# EAGLE schematic item_2022_Motherboard_02 (EAGLE 9.6.2)

## Sheet 1 of 2
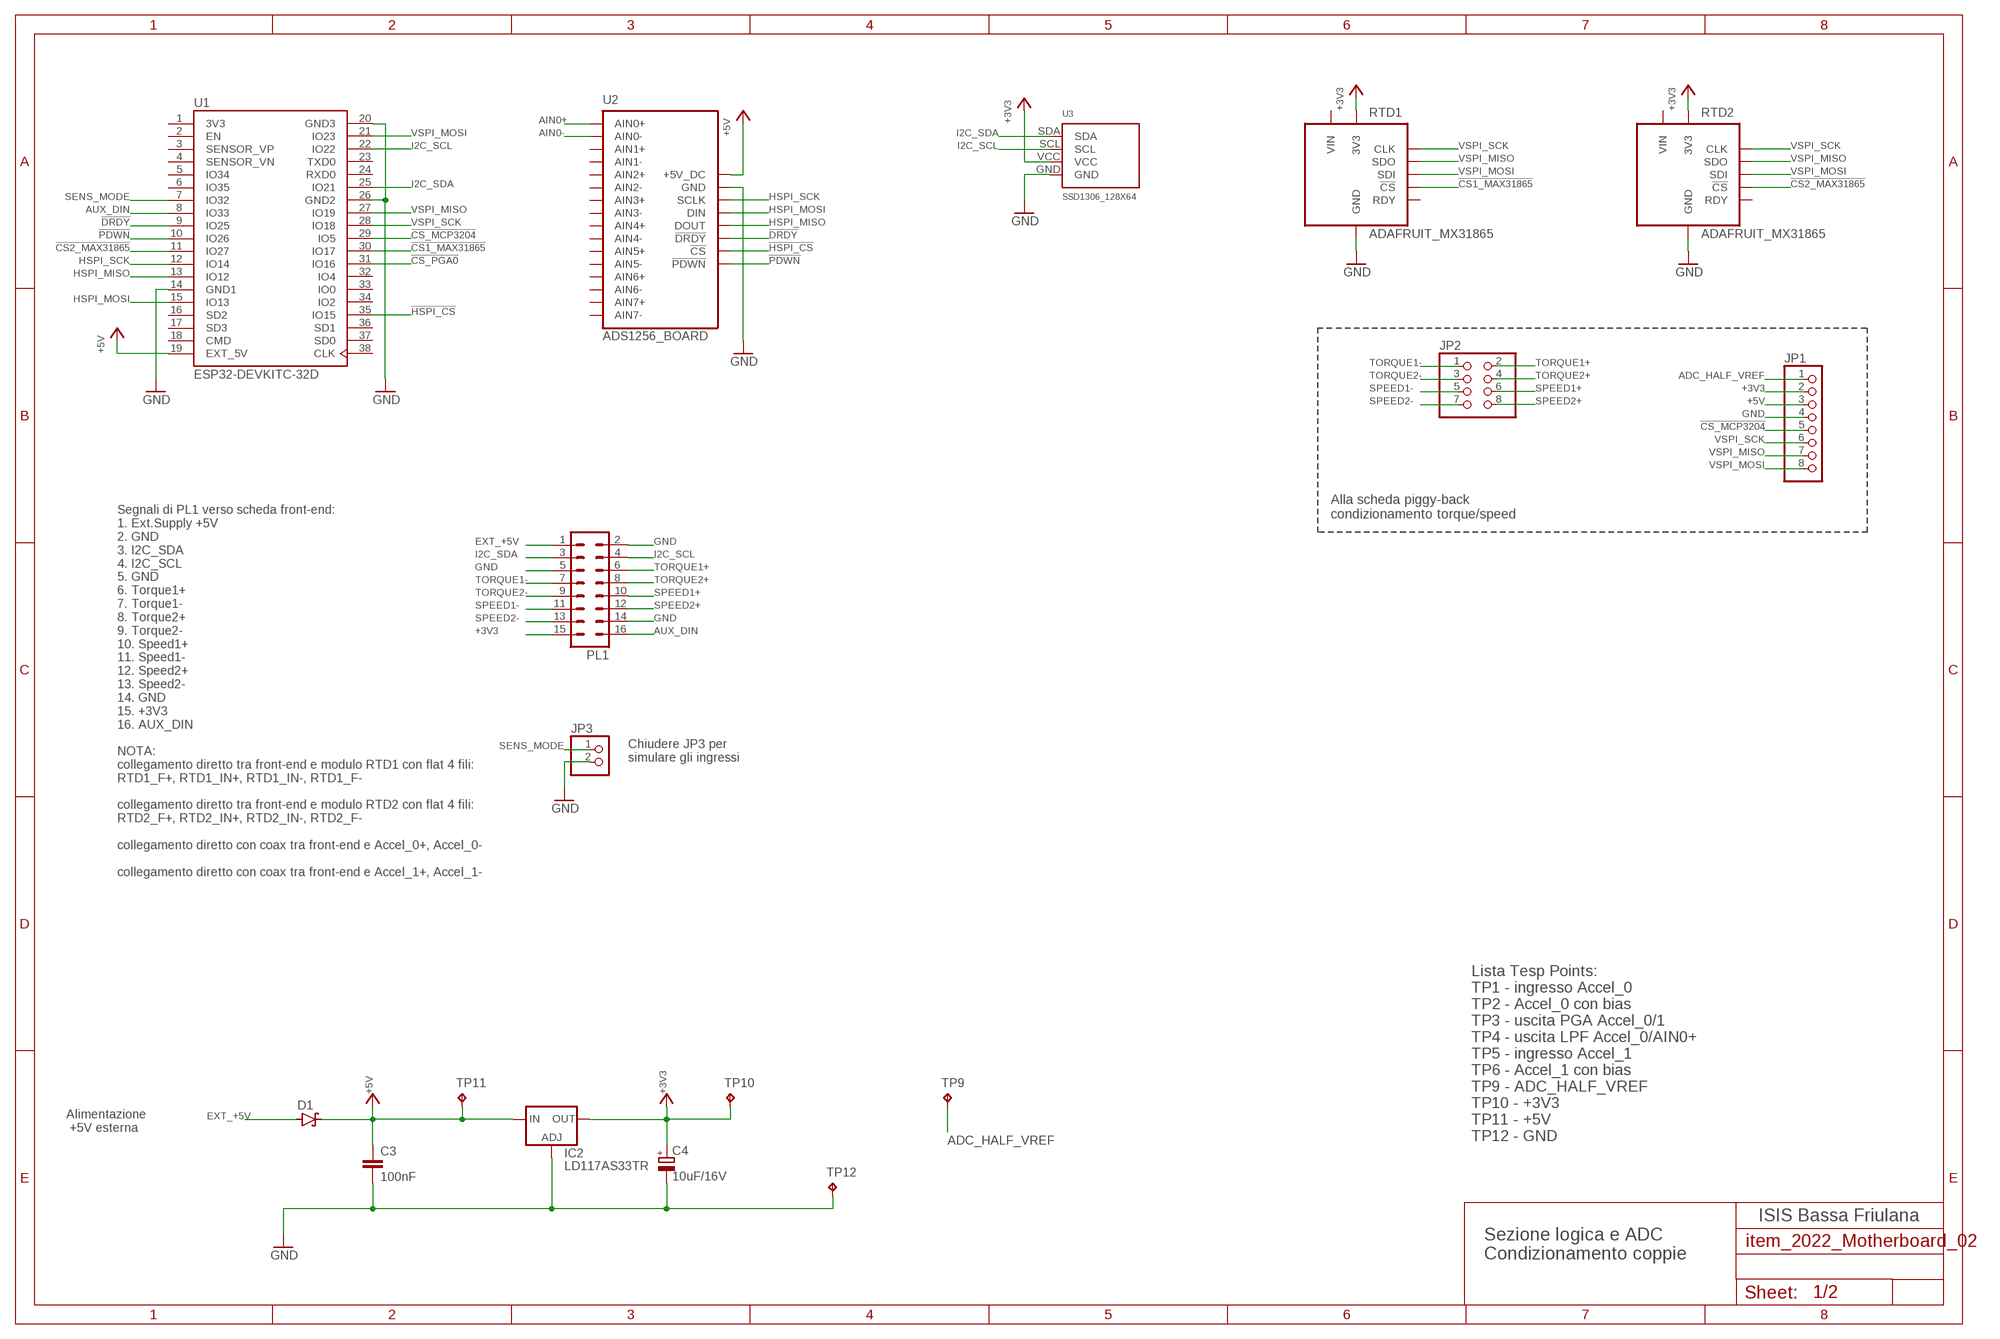
[diagram p0: schematic, sheet 1]

### Parts
C3  100nF  C-EUC0805K  [C0805K]
C4  10uF/16V  CPOL-EU153CLV-0405  [153CLV-0405]
D1  SCHOTTKY-DIODEDO35-7  [DO35-7]
IC2  LD117AS33TR  [SOT223]
JP1  PINHD-1X8  [1X08]
JP2  PINHD-2X4  [2X04]
JP3  PINHD-1X2  [1X02]
PL1  16V  [16V]
RTD1  ADAFRUIT_MX31865  [ADAFRUIT_MAX31865]
RTD2  ADAFRUIT_MX31865  [ADAFRUIT_MAX31865]
TP9  TPTP16SQ  [TP16SQ]
TP10  TPTP16SQ  [TP16SQ]
TP11  TPTP16SQ  [TP16SQ]
TP12  TPTP14R  [TP14R]
U1  ESP32-DEVKITC-32D  [MODULE_ESP32-DEVKITC-32D]
U2  ADS1256_BOARD  [ADS1256_BOARD]
U3  SSD1306_128X64  [128X64]

### Nets
!CS1_MAX31865!: RTD1.P7(!CS!) U1.30(IO17)
!CS2_MAX31865!: RTD2.P7(!CS!) U1.11(IO27)
!CS_MCP3204!: JP1.5 U1.29(IO5)
!CS_PGA0!: U1.31(IO16) ; also sheet 2
!DRDY!: U1.9(IO25) U2.!DRDY!
!HSPI_CS!: U1.35(IO15) U2.!CS!
!PDWN!: U1.10(IO26) U2.PDWN(!PDWN!)
+3V3: C4.+ IC2.4(OUT) JP1.2 PL1.15 RTD1.P3(3V3) RTD2.P3(3V3) TP10.TP U3.VCC
+5V: C3.1 D1.C IC2.3(IN) JP1.3 TP11.TP U1.19(EXT_5V) U2.5V_DC(+5V_DC) ; also sheet 2
ADC_HALF_VREF [supply]: JP1.1 TP9.TP ; also sheet 2
AIN0+: U2.AIN0+ ; also sheet 2
AIN0-: U2.AIN0- ; also sheet 2
AUX_DIN: PL1.16 U1.8(IO33)
EXT_+5V: D1.A PL1.1
GND: C3.2 C4.- IC2.1(ADJ) JP1.4 JP3.2 PL1.2 PL1.5 PL1.14 RTD1.P2(GND) RTD2.P2(GND) TP12.TP U1.14(GND1) U1.20(GND3) U1.26(GND2) U2.GND U3.GND ; also sheet 2
HSPI_MISO: U1.13(IO12) U2.DOUT
HSPI_MOSI: U1.15(IO13) U2.DIN
HSPI_SCK: U1.12(IO14) U2.SCLK
I2C_SCL: PL1.4 U1.22(IO22) U3.SCL
I2C_SDA: PL1.3 U1.25(IO21) U3.SDA
SENS_MODE: JP3.1 U1.7(IO32)
SPEED1+: JP2.6 PL1.10
SPEED1-: JP2.5 PL1.11
SPEED2+: JP2.8 PL1.12
SPEED2-: JP2.7 PL1.13
TORQUE1+: JP2.2 PL1.6
TORQUE1-: JP2.1 PL1.7
TORQUE2+: JP2.4 PL1.8
TORQUE2-: JP2.3 PL1.9
VSPI_MISO: JP1.7 RTD1.P5(SDO) RTD2.P5(SDO) U1.27(IO19)
VSPI_MOSI: JP1.8 RTD1.P6(SDI) RTD2.P6(SDI) U1.21(IO23) ; also sheet 2
VSPI_SCK: JP1.6 RTD1.P4(CLK) RTD2.P4(CLK) U1.28(IO18) ; also sheet 2
Unconnected: RTD1.P8(RDY) RTD2.P8(RDY) U1.2(EN) U1.3(SENSOR_VP) U1.4(SENSOR_VN) U1.5(IO34) U1.6(IO35) U1.16(SD2) U1.17(SD3) U1.18(CMD) U1.23(TXD0) U1.24(RXD0) U1.32(IO4) U1.33(IO0) U1.34(IO2) U1.36(SD1) U1.37(SD0) U1.38(CLK) U2.AIN1+ U2.AIN1- U2.AIN2+ U2.AIN2- U2.AIN3+ U2.AIN3- U2.AIN4+ U2.AIN4- U2.AIN5+ U2.AIN5- U2.AIN6+ U2.AIN6- U2.AIN7+ U2.AIN7-

### Notes on the sheet
- Alla scheda piggy-back
  condizionamento torque/speed
- Chiudere JP3 per
  simulare gli ingressi
- Segnali di PL1 verso scheda front-end:
  1. Ext.Supply +5V
  2. GND
  3. I2C_SDA
  4. I2C_SCL
  5. GND
  6. Torque1+
  7. Torque1-
  8. Torque2+
  9. Torque2-
  10. Speed1+
  11. Speed1-
  12. Speed2+
  13. Speed2-
  14. GND
  15. +3V3
  16. AUX_DIN
  
  NOTA:
  collegamento diretto tra front-end e modulo RTD1 con flat 4 fili:
  RTD1_F+, RTD1_IN+, RTD1_IN-, RTD1_F-
  
  collegamento diretto tra front-end e modulo RTD2 con flat 4 fili:
  RTD2_F+, RTD2_IN+, RTD2_IN-, RTD2_F-
  
  collegamento diretto con coax tra front-end e Accel_0+, Accel_0-
  
  collegamento diretto con coax tra front-end e Accel_1+, Accel_1-
- Alimentazione
   +5V esterna
- Lista Tesp Points:
  TP1 - ingresso Accel_0
  TP2 - Accel_0 con bias
  TP3 - uscita PGA Accel_0/1
  TP4 - uscita LPF Accel_0/AIN0+
  TP5 - ingresso Accel_1
  TP6 - Accel_1 con bias
  TP9 - ADC_HALF_VREF
  TP10 - +3V3
  TP11 - +5V
  TP12 - GND
- ISIS Bassa Friulana
- Sezione logica e ADC
  Condizionamento coppie

## Sheet 2 of 2
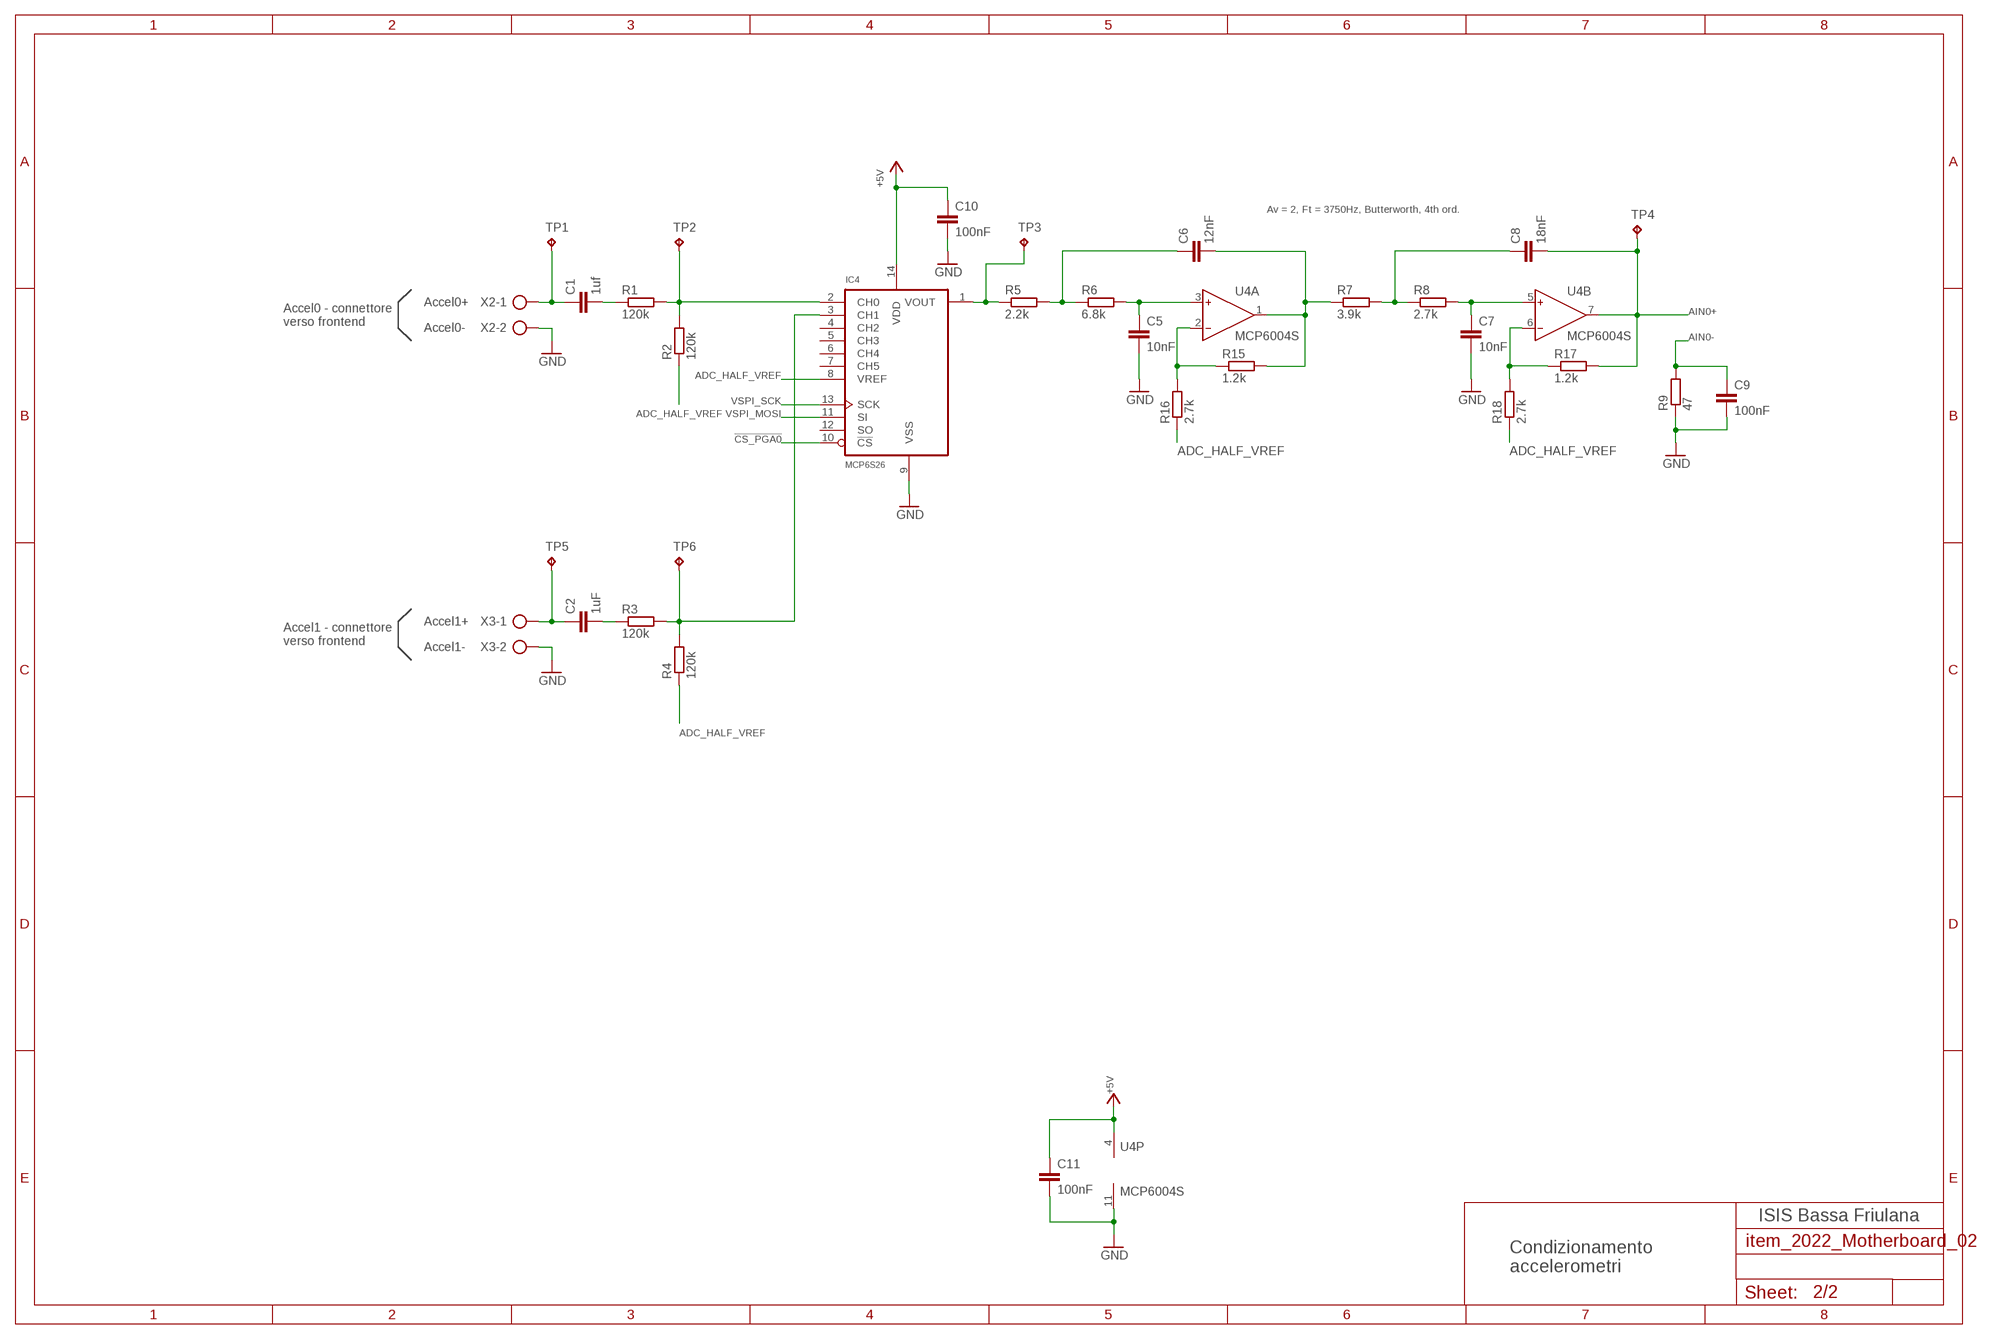
[diagram p1: schematic, sheet 2]

### Parts
C1  1uf  C-EUC1206  [C1206]
C2  1uF  C-EUC1206  [C1206]
C5  10nF  C-EUC0805K  [C0805K]
C6  12nF  C-EUC0805K  [C0805K]
C7  10nF  C-EUC0805K  [C0805K]
C8  18nF  C-EUC0805K  [C0805K]
C9  100nF  C-EUC0805K  [C0805K]
C10  100nF  C-EUC0805K  [C0805K]
C11  100nF  C-EUC0805K  [C0805K]
IC4  MCP6S26  [SO14]
R1  120k  R-EU_R0805  [R0805]
R2  120k  R-EU_R0805  [R0805]
R3  120k  R-EU_R0805  [R0805]
R4  120k  R-EU_R0805  [R0805]
R5  2.2k  R-EU_R0805  [R0805]
R6  6.8k  R-EU_R0805  [R0805]
R7  3.9k  R-EU_R0805  [R0805]
R8  2.7k  R-EU_R0805  [R0805]
R9  47  R-EU_R0805  [R0805]
R15  1.2k  R-EU_R0805  [R0805]
R16  2.7k  R-EU_R0805  [R0805]
R17  1.2k  R-EU_R0805  [R0805]
R18  2.7k  R-EU_R0805  [R0805]
TP1  TPTP14R  [TP14R]
TP2  TPTP14R  [TP14R]
TP3  TPTP14R  [TP14R]
TP4  TPTP14R  [TP14R]
TP5  TPTP14R  [TP14R]
TP6  TPTP14R  [TP14R]
U4  MCP6004S  [SO14]
X2  AK500/2  [AK500/2]
X3  AK500/2  [AK500/2]

### Nets
!CS_PGA0!: IC4.10(!CS!) ; also sheet 1
+5V: C10.1 C11.1 IC4.14(VDD) U4.4(P:V+) ; also sheet 1
ADC_HALF_VREF [supply]: IC4.8(VREF) R2.1 R4.1 R16.1 R18.1 ; also sheet 1
AIN0+: C8.2 R17.2 TP4.TP U4.7(B:OUT) ; also sheet 1
AIN0-: C9.1 R9.2 ; also sheet 1
GND: C5.2 C7.2 C9.2 C10.2 C11.2 IC4.9(VSS) R9.1 U4.11(P:V-) X2.2 X3.2 ; also sheet 1
N$2: C1.1 TP1.TP X2.1
N$3: C2.1 TP5.TP X3.1
N$4: IC4.2(CH0) R1.2 R2.2 TP2.TP
N$5: IC4.1(VOUT) R5.1 TP3.TP
N$6: C1.2 R1.1
N$7: C2.2 R3.1
N$8: R15.1 R16.2 U4.2(A:IN-)
N$9: C6.1 R5.2 R6.1
N$10: C5.1 R6.2 U4.3(A:IN+)
N$11: C6.2 R7.1 R15.2 U4.1(A:OUT)
N$12: C8.1 R7.2 R8.1
N$13: C7.1 R8.2 U4.5(B:IN+)
N$14: IC4.3(CH1) R3.2 R4.2 TP6.TP
N$21: R17.1 R18.2 U4.6(B:IN-)
VSPI_MOSI: IC4.11(SI) ; also sheet 1
VSPI_SCK: IC4.13(SCK) ; also sheet 1
Unconnected: IC4.4(CH2) IC4.5(CH3) IC4.6(CH4) IC4.7(CH5) IC4.12(SO) U4.8(C:OUT) U4.9(C:IN-) U4.10(C:IN+) U4.12(D:IN+) U4.13(D:IN-) U4.14(D:OUT)

### Notes on the sheet
- Av = 2, Ft = 3750Hz, Butterworth, 4th ord.
- Accel0+
- Accel0 - connettore 
  verso frontend
- Accel0-
- Accel1+
- Accel1 - connettore 
  verso frontend
- Accel1-
- ISIS Bassa Friulana
- Condizionamento
  accelerometri

## Power pins joined to a net without a drawn wire
3V3: U1.1(3V3)
VIN: RTD1.P1(VIN) RTD2.P1(VIN)

## Library data of the parts
C1-C3 C5-C11 = rcl:C-EU: CAPACITOR, European symbol; SPICEPREFIX: C
C4 = rcl:CPOL-EU: POLARIZED CAPACITOR, European symbol; SPICEPREFIX: C
D1 = diode:SCHOTTKY-DIODE: Schottky Diode
IC2 = v-reg:LD117A?*: Low drop fixed and adjustable positive voltage regulators 1 A Source: http://www.st.com/stonline/products/literature/ds/7194/ld1117axx.pdf
IC4 = microchip_opamp:MCP6S26: MCP6S26 Six channels analog Programmable Gain Amplifier with SPI interface
JP1 = pinhead:PINHD-1X8: PIN HEADER
JP2 = pinhead:PINHD-2X4: PIN HEADER
JP3 = pinhead:PINHD-1X2: PIN HEADER
PL1 = con-harting-v:16V: CONNECTOR; OC_FARNELL: unknown; OC_NEWARK: unknown
R1-R9 R15-R18 = rcl:R-EU_: RESISTOR, European symbol; SPICEPREFIX: R
RTD1 RTD2 = Adafruit_MAX31865_RTD:ADAFRUIT_MX31865: Adafruit MAX31865 - Adafruit MAX31865 RTD PT100 or PT1000 Amplifier
TP1-TP6 TP9-TP12 = testpad:TP: Test pad
U1 = ESP32-DEVKITC-32D:ESP32-DEVKITC-32D: Eval Board For Esp-Wroom-32 Check prices <https://pricing.snapeda.com/parts/ESP32-DEVKITC-32D/Espressif%20Systems/view-part?ref=eda>; AVAILABILITY: Warning; DESCRIPTION: WiFi Development Tools (802.11) ESP32 General Development Kit, ESP32-WROOM-32D on the board; MF: Espressif Systems; MP: ESP32-DEVKITC-32D; PACKAGE: None; PRICE: None; PURCHASE-URL: https://pricing.snapeda.com/search/part/ESP32-DEVKITC-32D/?ref=eda
U2 = ADS1256:ADS1256_BOARD: Board 8 Channels - ADS1256 24bit
U3 = ssd1306oled:SSD1306_128X64: OLED Display Board 0.91" 128x64 White I2C - 4 Pins - SSD1306
U4 = microchip_opamp:MCP6004: MCP6004
X2 X3 = con-ptr500:AK500/2: CONNECTOR; OC_FARNELL: unknown; OC_NEWARK: unknown

## Net classes
1 supply: width 0.406 mm, drill 0.305 mm, clearance 0.356 mm to class 0, clearance 0.356 mm
2 digital: width 0.203 mm, drill 0.254 mm, clearance 0.254 mm to class 0, clearance 0.305 mm to class 1, clearance 0.203 mm